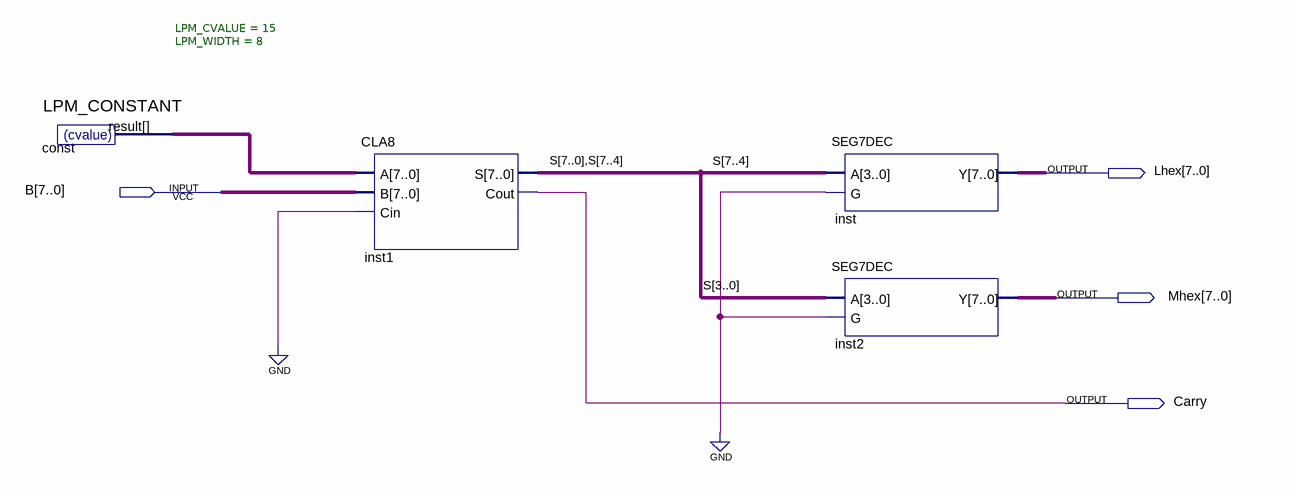
[diagram p0: schematic sheet]
// Quartus schematic CLA8seg7.bdf as structural Verilog: 4 symbols, 4 pins
module CLA8seg7 (
  input  [7:0] B,
  output [7:0] Lhex,
  output [7:0] Mhex,
  output Carry
);

  wire [7:0] const_result, S;

  LPM_CONSTANT #(.LPM_CVALUE(15), .LPM_WIDTH(8)) \const  (.result(const_result));
  CLA8 inst1 (.A(const_result), .B(B), .Cin(1'b0), .S({S, S[7:4]}), .Cout(Carry));
  SEG7DEC inst (.A(S[7:4]), .G(1'b0), .Y(Lhex));
  SEG7DEC inst2 (.A(S[3:0]), .G(1'b0), .Y(Mhex));
endmodule
